# EAGLE design S5D3_MCU_only_edge_Power_SPI (EAGLE 9.6.2)
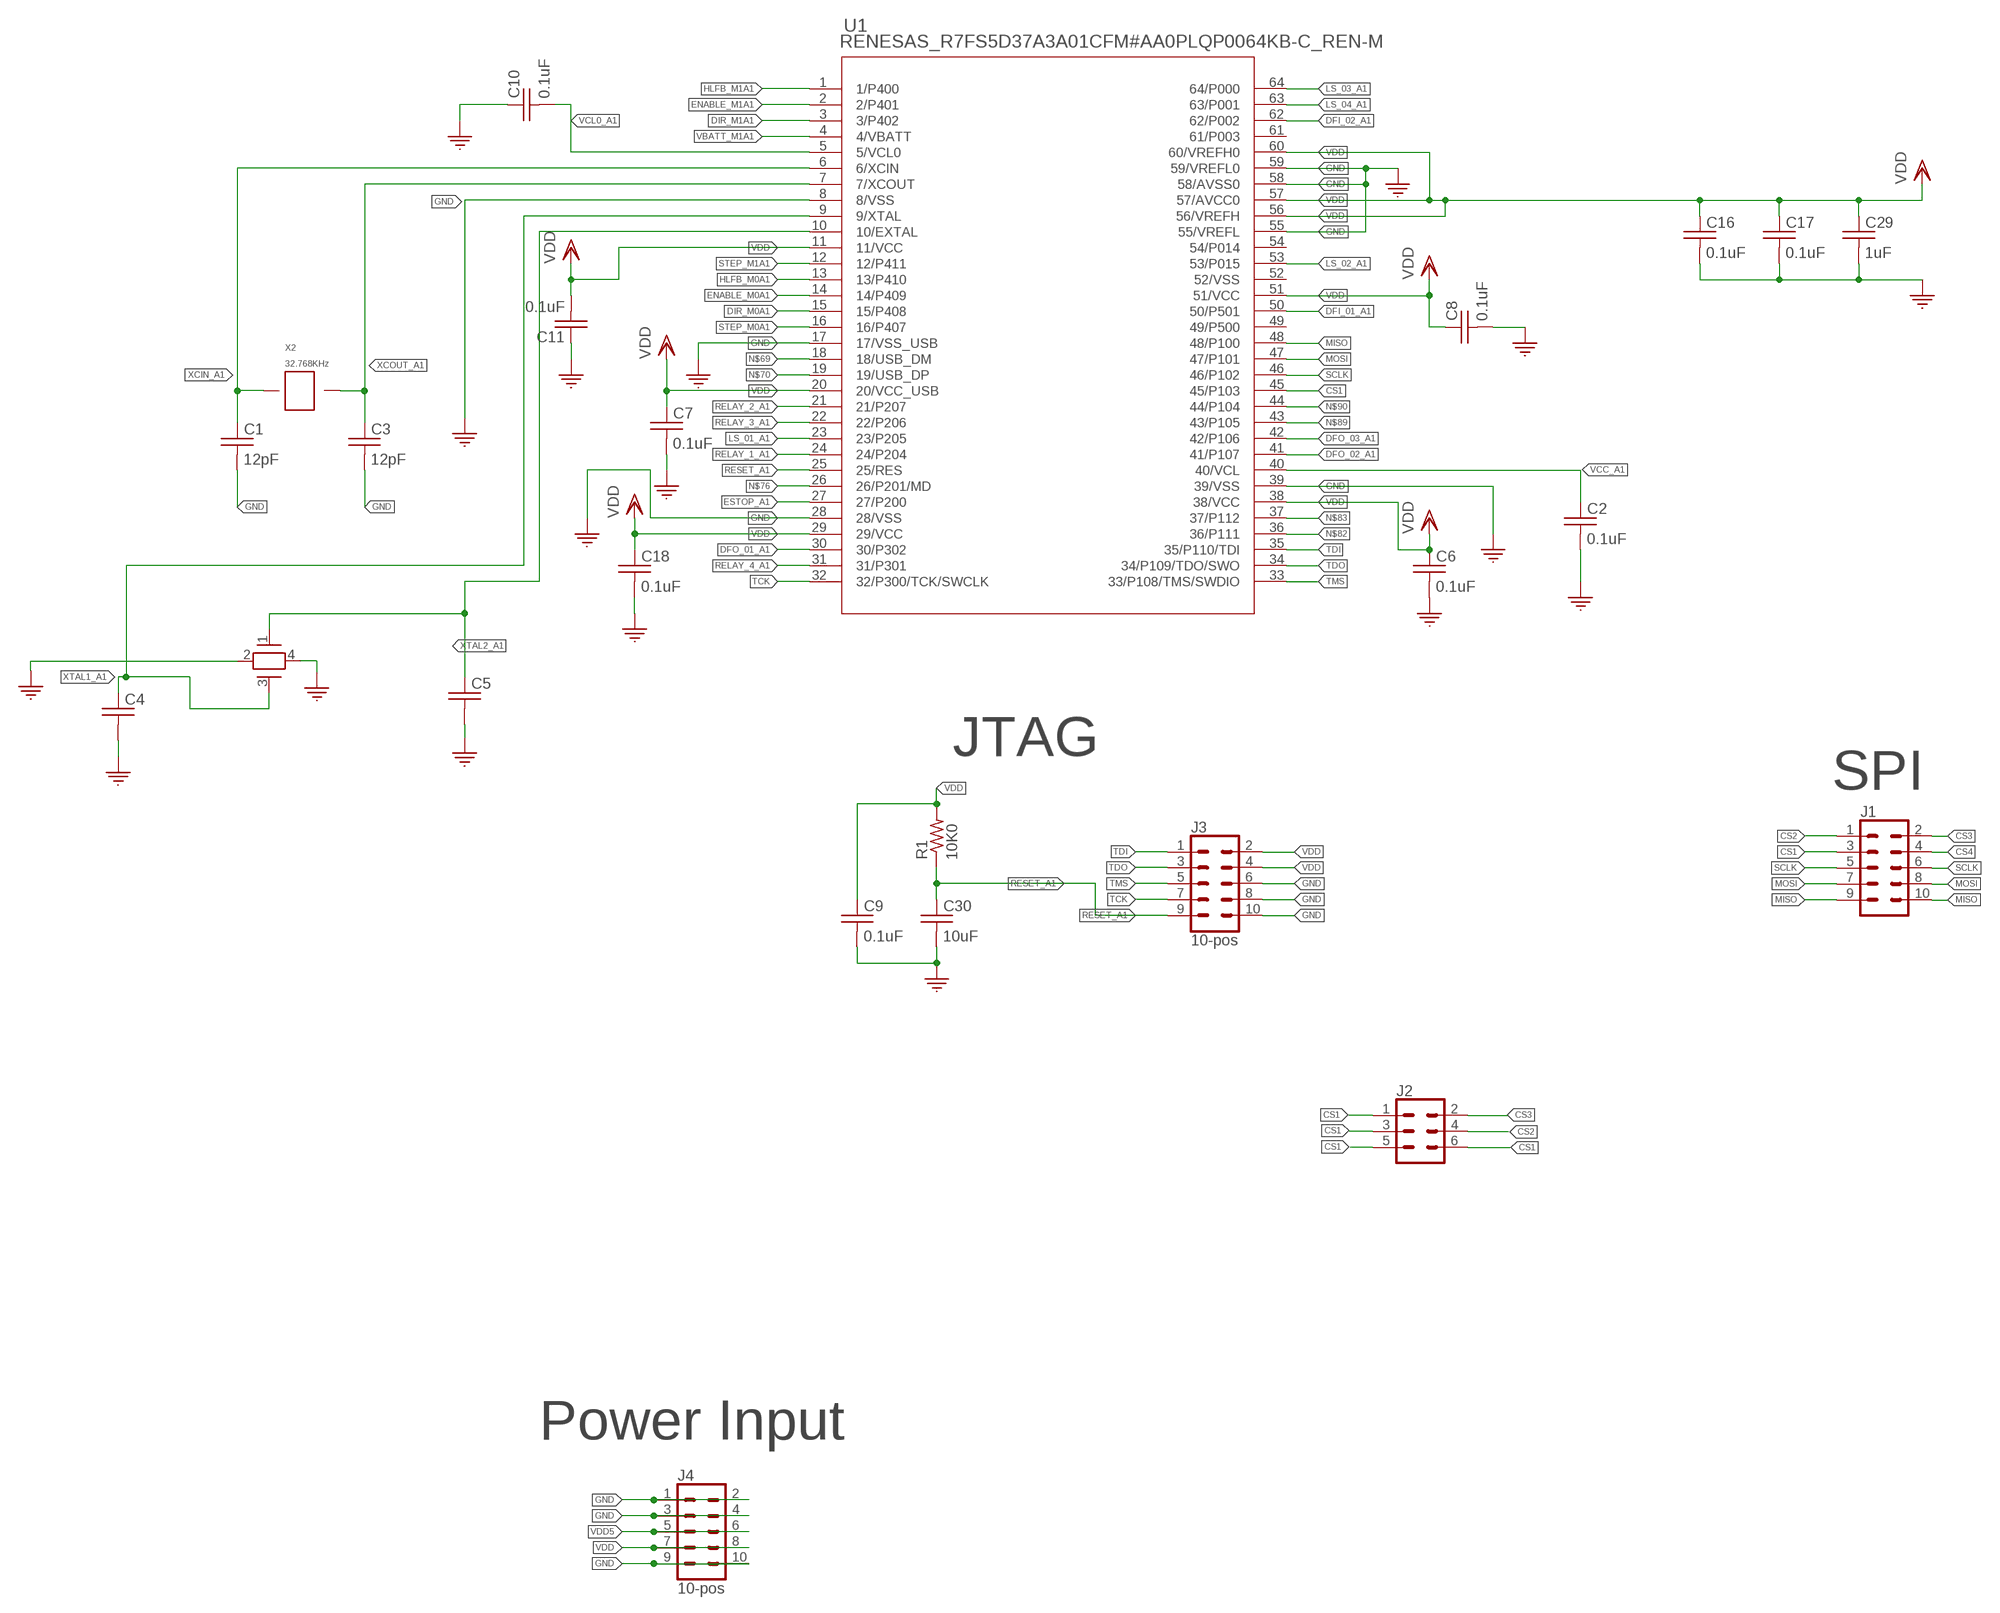
[diagram p0: schematic, sheet 1]

## Parts
C1  12pF  C_0402_12PF  [0402]
C2  0.1uF  C_0402_0.1UF  [0402]
C3  12pF  C_0402_12PF  [0402]
C4  10pF  C_0402_10PF  [0402]
C5  10pF  C_0402_10PF  [0402]
C6  0.1uF  C_0402_0.1UF  [0402]
C7  0.1uF  C_0402_0.1UF  [0402]
C8  0.1uF  C_0402_0.1UF  [0402]
C9  0.1uF  C_0402_0.1UF  [0402]
C10  0.1uF  C_0402_0.1UF  [0402]
C11  0.1uF  C_0402_0.1UF  [0402]
C16  0.1uF  C_0402_0.1UF  [0402]
C17  0.1uF  C_0402_0.1UF  [0402]
C18  0.1uF  C_0402_0.1UF  [0402]
C29  1uF  C_0402_1UF  [0402]
C30  10uF  C_0402_10UF  [0402]
J1  CONN_05X2PTH  [2X5]
J2  CONN_03X2  [2X3]
J3  10-pos  CONN_05X2_RAPTH  [2X5]
J4  10-pos  CONN_05X2_RAPTH  [2X5]
R1  10K0  R_0402_10K0  [0402]
U1  RENESAS_R7FS5D37A3A01CFM#AA0PLQP0064KB-C_REN-M  [PLQP0064KB-C_REN-M]
X2  32.768KHz  XTAL_32.768KHZ  [SMD_X_2_PADS]
Y1  XTAL_12MHZ_ABM8G-12.000MHZ-B4Y-T  [CRYSTAL_ABM8G_ABR]

## Nets
CS1: J1.3 J2.1 J2.3 J2.5 J2.6 U1.45(45/P103)
CS2: J1.1 J2.4
CS3: J1.2 J2.2
CS4: J1.4
DFI_01_A1: U1.50(50/P501)
DFI_02_A1: U1.62(62/P002)
DFO_01_A1: U1.30(30/P302)
DFO_02_A1: U1.41(41/P107)
DFO_03_A1: U1.42(42/P106)
DIR_M0A1: U1.15(15/P408)
DIR_M1A1: U1.3(3/P402)
ENABLE_M0A1: U1.14(14/P409)
ENABLE_M1A1: U1.2(2/P401)
ESTOP_A1: U1.27(27/P200)
GND: C1.P$2 C2.P$2 C3.P$2 C4.P$2 C5.P$2 C6.P$2 C7.P$2 C8.P$2 C9.P$2 C10.P$1 C11.P$1 C16.P$2 C17.P$2 C18.P$2 C29.P$2 C30.P$2 J3.6 J3.8 J3.10 J4.1 J4.2 J4.3 J4.4 J4.9 J4.10 U1.8(8/VSS) U1.17(17/VSS_USB) U1.28(28/VSS) U1.39(39/VSS) U1.55(55/VREFL) U1.58(58/AVSS0) U1.59(59/VREFL0) Y1.2 Y1.4
HLFB_M0A1: U1.13(13/P410)
HLFB_M1A1: U1.1(1/P400)
LS_01_A1: U1.23(23/P205)
LS_02_A1: U1.53(53/P015)
LS_03_A1: U1.64(64/P000)
LS_04_A1: U1.63(63/P001)
MISO: J1.9 J1.10 U1.48(48/P100)
MOSI: J1.7 J1.8 U1.47(47/P101)
N$69: U1.18(18/USB_DM)
N$70: U1.19(19/USB_DP)
N$76: U1.26(26/P201/MD)
N$82: U1.36(36/P111)
N$83: U1.37(37/P112)
N$89: U1.43(43/P105)
N$90: U1.44(44/P104)
RELAY_1_A1: U1.24(24/P204)
RELAY_2_A1: U1.21(21/P207)
RELAY_3_A1: U1.22(22/P206)
RELAY_4_A1: U1.31(31/P301)
RESET_A1: C30.P$1 J3.9 R1.P$1 U1.25(25/RES)
SCLK: J1.5 J1.6 U1.46(46/P102)
STEP_M0A1: U1.16(16/P407)
STEP_M1A1: U1.12(12/P411)
TCK: J3.7 U1.32(32/P300/TCK/SWCLK)
TDI: J3.1 U1.35(35/P110/TDI)
TDO: J3.3 U1.34(34/P109/TDO/SWO)
TMS: J3.5 U1.33(33/P108/TMS/SWDIO)
VBATT_M1A1: U1.4(4/VBATT)
VCC_A1: C2.P$1 U1.40(40/VCL)
VCL0_A1: C10.P$2 U1.5(5/VCL0)
VDD: C6.P$1 C7.P$1 C8.P$1 C9.P$1 C11.P$2 C16.P$1 C17.P$1 C18.P$1 C29.P$1 J3.2 J3.4 J4.7 J4.8 R1.P$2 U1.11(11/VCC) U1.20(20/VCC_USB) U1.29(29/VCC) U1.38(38/VCC) U1.51(51/VCC) U1.56(56/VREFH) U1.57(57/AVCC0) U1.60(60/VREFH0)
VDD5: J4.5 J4.6
XCIN_A1: C1.P$1 U1.6(6/XCIN) X2.P$1
XCOUT_A1: C3.P$1 U1.7(7/XCOUT) X2.P$2
XTAL1_A1: C4.P$1 U1.9(9/XTAL) Y1.3
XTAL2_A1: C5.P$1 U1.10(10/EXTAL) Y1.1
Unconnected: U1.49(49/P500) U1.52(52/VSS) U1.54(54/P014) U1.61(61/P003)

## Notes on the sheet
- JTAG
- SPI
- Power Input

## Library data of the parts
C1 C3 = 3D_MIG_Controller:C_0402_12PF; PARTNO: CL05C120JB5NNNC
C2 C6-C11 C16-C18 = 3D_MIG_Controller:C_0402_0.1UF; PARTNO: CL05F104ZO5NNNC
C4 C5 = 3D_MIG_Controller:C_0402_10PF; PARTNO: CC0402JRNPO9BN100
C29 = 3D_MIG_Controller:C_0402_1UF; PARTNO: CL05A105KO5NNNC
C30 = 3D_MIG_Controller:C_0402_10UF; PARTNO: CL05A106MP8NUB8
J1 = 3D_MIG_Controller:CONN_05X2: Multi connection point. Often used as Generic Header-pin footprint for 0.1 inch spaced/style header connections For AVR SPI programming port, see special device with nice symbol: "AVR_SPI_PROG_5x2.dev" You can populate with any combo of single row headers, but if you'd like an exact match, check these: 2x5 AVR ICSP Male Header <https://www.sparkfun.com/products/778> (PRT-00778) 2x5 Pin Shrouded Header <https://www.sparkfun.com/products/8506> (PRT-08506) On any of the 0.1 inch spaced packages, you can populate with these: Break Away Headers - Straight <https://www.sparkfun.com/products/116> (PRT-00116) Break Away Male Headers - Right Angle <https://www.sparkfun.com/products/553> (PRT-00553) Female Headers <https://www.sparkfun.com/products/115> (PRT-00115) Break Away Headers - Machine Pin <https://www.sparkfun.com/products/117> (PRT-00117) Break Away Female Headers - Swiss Machine Pin <https://www.sparkfun.com/products/743> (PRT-00743) Special note: the shrouded connector mates well with our 5x2 ribbon cables: 2x5 Pin IDC Ribbon Cable <https://www.sparkfun.com/products/8535> (PRT-08535); PROD_ID: CONN-08499; SF_ID: PRT-0778
J2 = 3D_MIG_Controller:CONN_03X2: Multi connection point. Often used as Generic Header-pin footprint for 0.1 inch spaced/style header connections For AVR SPI programming port, see special device with nice symbol: "AVR_SPI_PROG_5x2.dev" You can populate with any combo of single row headers, but if you'd like an exact match, check these: 2x5 AVR ICSP Male Header <https://www.sparkfun.com/products/778> (PRT-00778) 2x5 Pin Shrouded Header <https://www.sparkfun.com/products/8506> (PRT-08506) On any of the 0.1 inch spaced packages, you can populate with these: Break Away Headers - Straight <https://www.sparkfun.com/products/116> (PRT-00116) Break Away Male Headers - Right Angle <https://www.sparkfun.com/products/553> (PRT-00553) Female Headers <https://www.sparkfun.com/products/115> (PRT-00115) Break Away Headers - Machine Pin <https://www.sparkfun.com/products/117> (PRT-00117) Break Away Female Headers - Swiss Machine Pin <https://www.sparkfun.com/products/743> (PRT-00743) Special note: the shrouded connector mates well with our 5x2 ribbon cables: 2x5 Pin IDC Ribbon Cable <https://www.sparkfun.com/products/8535> (PRT-08535)
J3 J4 = 3D_MIG_Controller:CONN_05X2_RA: Connector Header Through Hole, Right Angle 10 position 0.100" (2.54mm); PARTNO: PH2RA-10-UA
R1 = 3D_MIG_Controller:R_0402_10K0; PARTNO: RMCF0402JT10K0
U1 = 3D_MIG_Controller:RENESAS_R7FS5D37A3A01CFM#AA0; COPYRIGHT: Copyright (C) 2023 Ultra Librarian. All rights reserved.; MFR_NAME: Renesas Electronics; PARTNO: R7FS3A37A3A01CFM#AA0
X2 = 3D_MIG_Controller:XTAL_32.768KHZ; PARTNO: ABS07-32.768KHZ-T
Y1 = 3D_MIG_Controller:XTAL_12MHZ_ABM8G-12.000MHZ-B4Y-T; COPYRIGHT: Copyright (C) 2023 Ultra Librarian. All rights reserved.; MFR_NAME: Abracon; PARTNO: ABM8G-12.000MHZ-B4Y-T

## Board
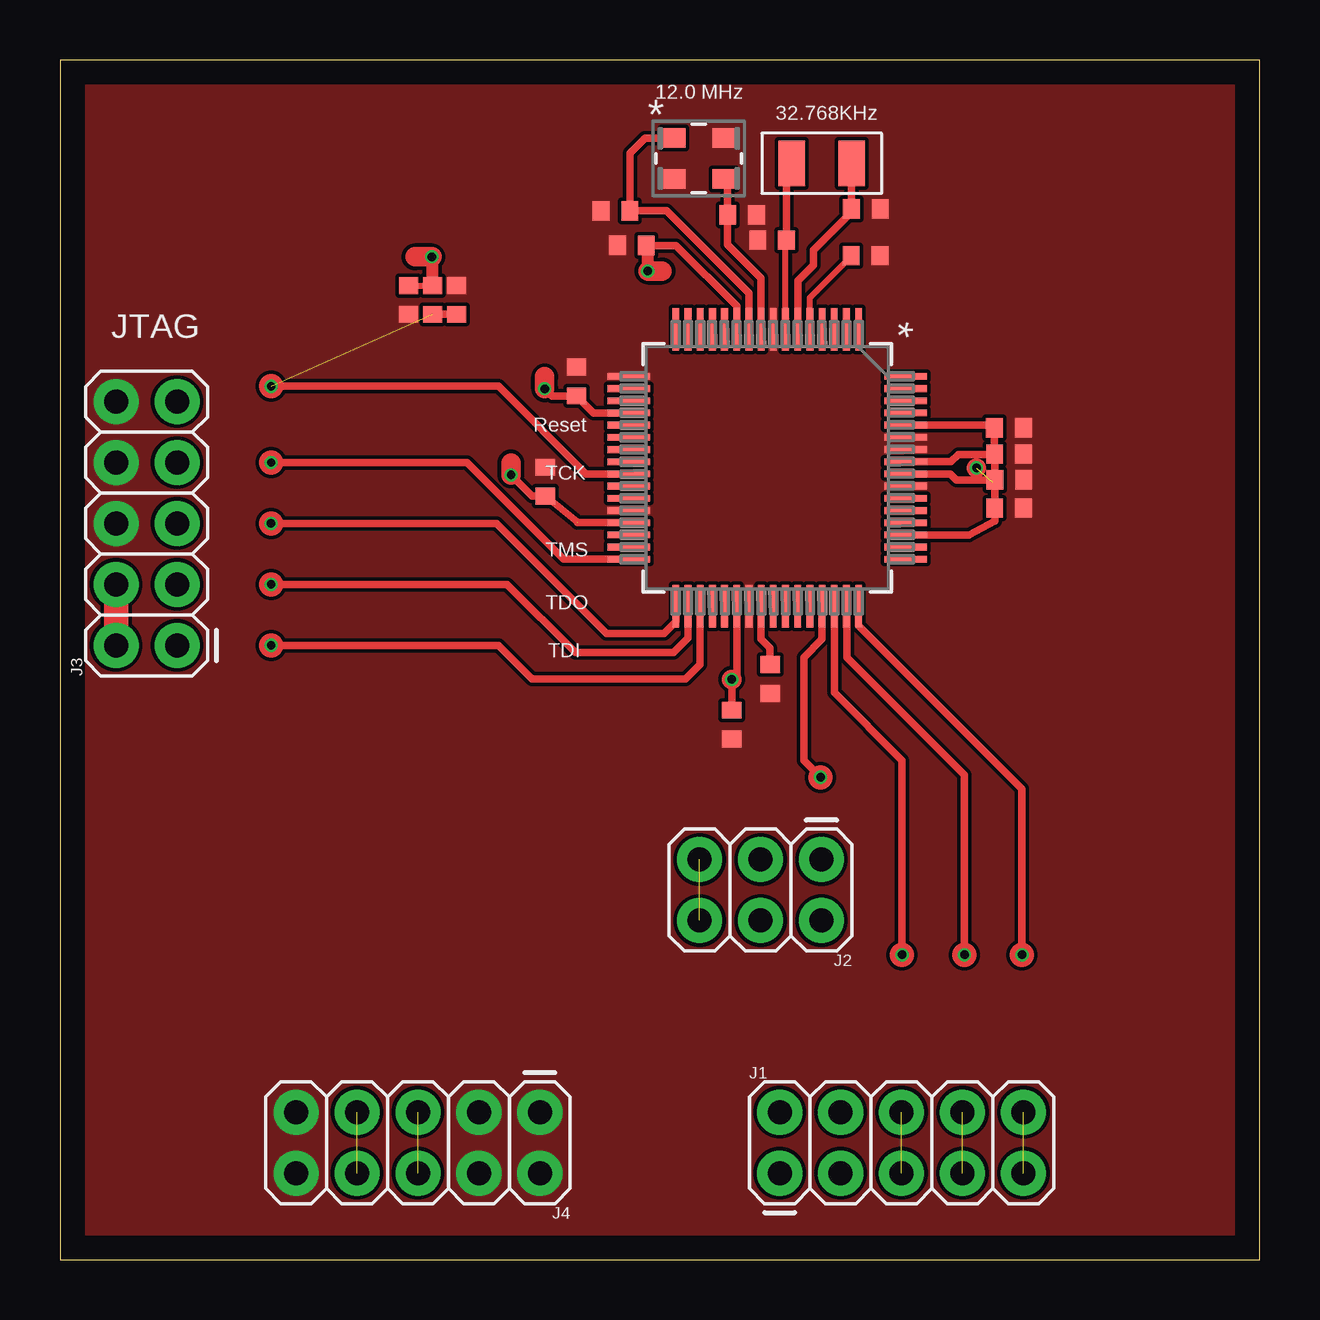
[diagram p1: board, top side]
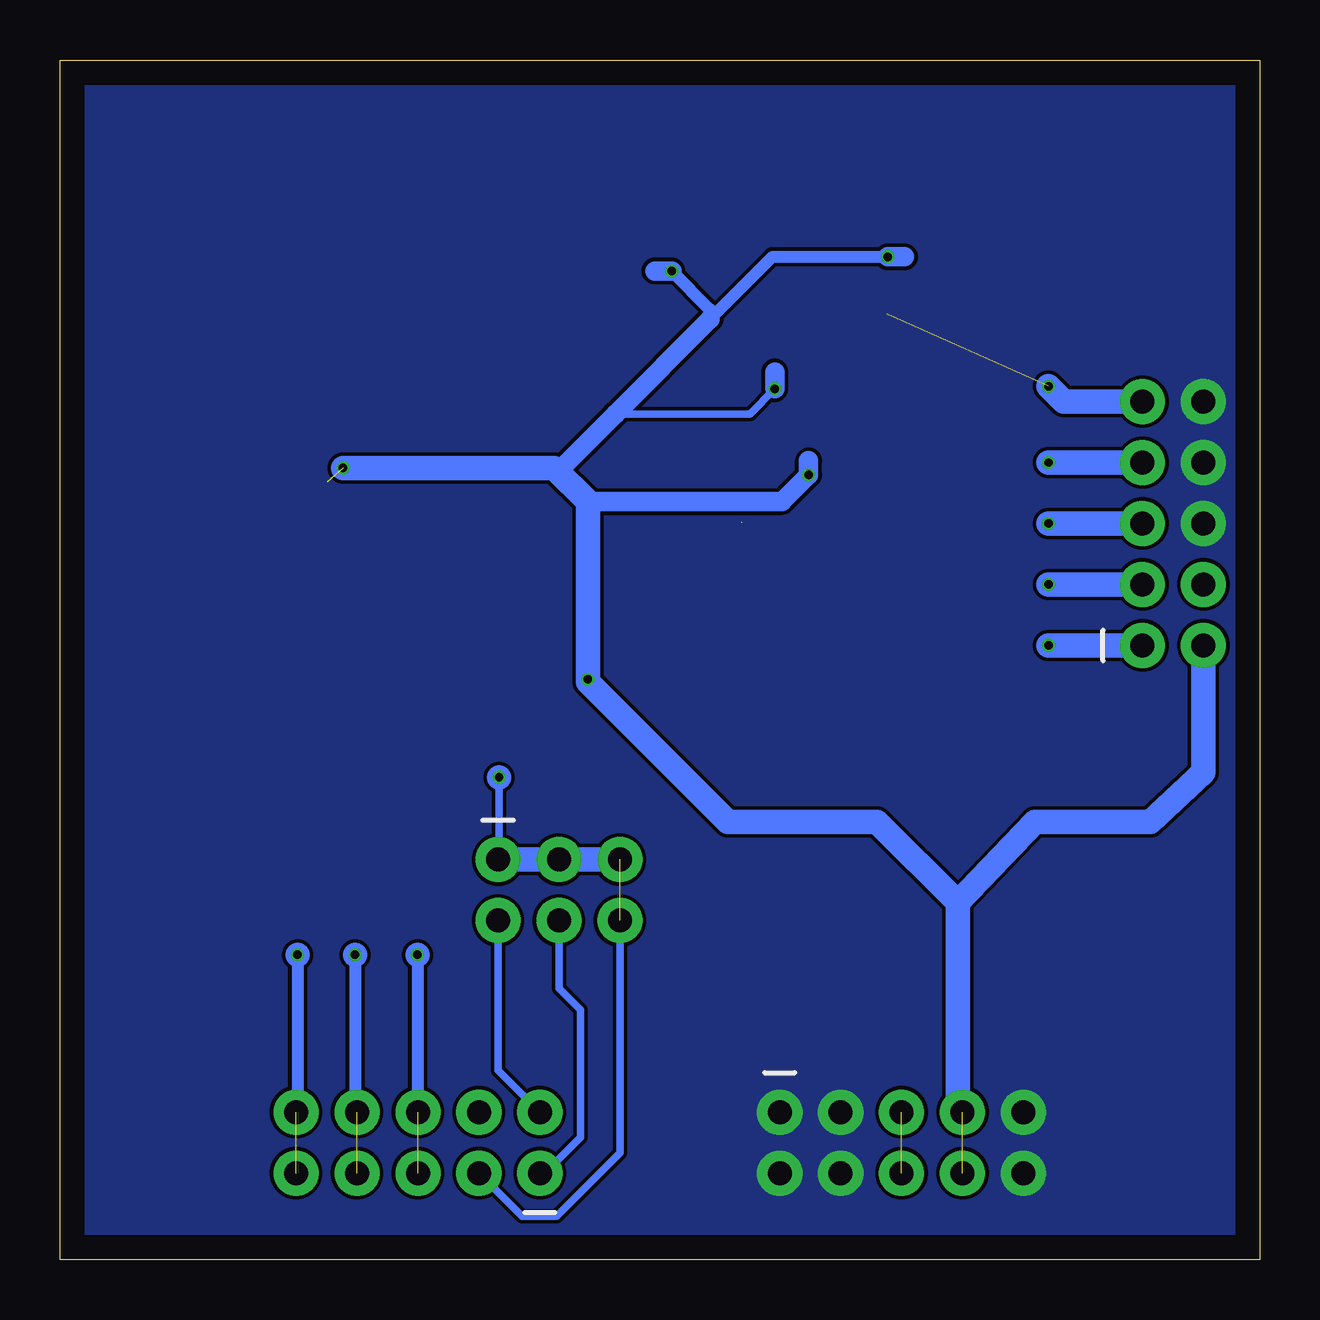
[diagram p2: board, bottom side, seen from below]

Size 50 x 50 mm. Coordinates in mm from the lower left corner, seen from the top.
Outline: 0,0 50,0 50,50 0,50 0,0
Copper layers (1*16): Top 0.035mm / dielectric 1.5mm / Bottom 0.035mm
Design rules "default": minimum track width 6mil, minimum drill 0.2mm, track to track 6mil, track to pad 6mil, pad to pad 6mil, via to via 6mil, smd to smd 6mil, copper to edge 40mil, drill to drill 6mil, minimum pad ring 10mil, minimum via ring 4mil, stop-mask expansion 4mil, vias tented up to drill 0mil, thermal gap 10mil

### Footprints (pad centres in the part's own frame; a part is rotated, then mirrored left to right if it is on the bottom)
0402 = smd 0.8 x 0.7: P$1 0,0.6; P$2 0,-0.6
2X5 = drill 1 pad 1.88: 1 0,0; 2 0,2.54; 3 2.54,0; 4 2.54,2.54; 5 5.08,0; 6 5.08,2.54; 7 7.62,0; 8 7.62,2.54; 9 10.16,0; 10 10.16,2.54
2X3 = drill 1 pad 1.88: 1 -2.54,-1.27; 2 -2.54,1.27; 3 0,-1.27; 4 0,1.27; 5 2.54,-1.27; 6 2.54,1.27
PLQP0064KB-C_REN-M = smd 1.778 x 0.279: 1 -5.766,3.81; 2 -5.766,3.302; 3 -5.766,2.794; 4 -5.766,2.286; 5 -5.766,1.778; 6 -5.766,1.27; 7 -5.766,0.762; 8 -5.766,0.254; 9 -5.766,-0.254; 10 -5.766,-0.762; 11 -5.766,-1.27; 12 -5.766,-1.778; 13 -5.766,-2.286; 14 -5.766,-2.794; 15 -5.766,-3.302; 16 -5.766,-3.81; 33 5.766,-3.81; 34 5.766,-3.302; 35 5.766,-2.794; 36 5.766,-2.286; 37 5.766,-1.778; 38 5.766,-1.27; 39 5.766,-0.762; 40 5.766,-0.254; 41 5.766,0.254; 42 5.766,0.762; 43 5.766,1.27; 44 5.766,1.778; 45 5.766,2.286; 46 5.766,2.794; 47 5.766,3.302; 48 5.766,3.81 | smd 0.279 x 1.778: 17 -3.81,-5.766; 18 -3.302,-5.766; 19 -2.794,-5.766; 20 -2.286,-5.766; 21 -1.778,-5.766; 22 -1.27,-5.766; 23 -0.762,-5.766; 24 -0.254,-5.766; 25 0.254,-5.766; 26 0.762,-5.766; 27 1.27,-5.766; 28 1.778,-5.766; 29 2.286,-5.766; 30 2.794,-5.766; 31 3.302,-5.766; 32 3.81,-5.766; 49 3.81,5.766; 50 3.302,5.766; 51 2.794,5.766; 52 2.286,5.766; 53 1.778,5.766; 54 1.27,5.766; 55 0.762,5.766; 56 0.254,5.766; 57 -0.254,5.766; 58 -0.762,5.766; 59 -1.27,5.766; 60 -1.778,5.766; 61 -2.286,5.766; 62 -2.794,5.766; 63 -3.302,5.766; 64 -3.81,5.766
SMD_X_2_PADS = smd 1.9 x 1.1: P$1 0,1.25; P$2 0,-1.25
CRYSTAL_ABM8G_ABR = smd 0.991 x 0.813: 1 -1.054,0.85; 2 -1.054,-0.85; 3 1.054,-0.85; 4 1.054,0.85

### Placement (x,y rotation side)
C1  33.59,43.79 90 top
C2  29.6,24.2 0 top
C3  29.68,42.49 270 top
C4  28.43,43.54 90 top
C5  23.15,43.71 270 top
C6  28,22.3 0 top
C7  21.53,36.6 180 top
C8  39.56,31.32 90 top
C9  14.53,40 0 top
C10  33.58,41.85 270 top
C11  23.84,42.27 90 top
C16  39.57,32.5 90 top
C17  39.56,33.57 90 top
C18  20.23,32.42 180 top
C29  39.55,34.67 90 top
C30  16.53,40 180 top
J1  30,3.6 0 top
J2  29.2,15.4 180 top
J3  4.88,25.6 90 top
J4  20,6.14 180 top
R1  15.53,40 180 top
U1  29.48,33 270 top
X2  31.75,45.69 270 top
Y1  26.63,45.9 0 top

### Tracks (layer width: path | path; a pad name or v marks a point on that pad's centre or on a via)
CS1  (via drill 0.35)  (1 unrouted)
  Top 0.305: U1.45 31.77,25.87 31,25.1 31,20.8 v31.7,20.1
  Top 1.016: v31.7,20.1
  Bottom 0.305: v31.7,20.1 31.7,16.71 J2.1 | J1.3 30.74,1.8 29.3,1.8 26.66,4.44 J2.6
  Bottom 1.016: J2.1 J2.3 J2.5 | v31.7,20.1
CS2
  Bottom 0.305: J1.1 29.8,3.6 28.3,5.1 28.3,10.4 29.2,11.3 J2.4
CS3
  Bottom 0.305: J1.2 31.74,7.88 J2.2
GND
  pour Top (no thermals): 0,50 50,50 50,0 0,0
  pour Bottom (no thermals): 0,50 50,50 50,0 0,0
MISO  (via drill 0.35)  (1 unrouted)
  Top 0.305: U1.48 33.29,26.43 40.1,19.62 v40.1,12.7
  Top 1.016: v40.1,12.7
  Bottom 0.508: v40.1,12.7 40.1,6.2 J1.10
  Bottom 1.016: v40.1,12.7
MOSI  (via drill 0.35)  (1 unrouted)
  Top 0.305: U1.47 32.8,27.22 32.8,25.1 37.7,20.2 v37.7,12.7
  Top 1.016: v37.7,12.7
  Bottom 0.508: v37.7,12.7 37.7,6.22 J1.8
  Bottom 1.016: v37.7,12.7
RESET_A1  (via drill 0.35)  (1 unrouted)
  Top 0.305: C30.P$1 R1.P$1 | U1.25 21.93,32.75 18.28,36.4 v8.8,36.4
  Top 1.016: v8.8,36.4
  Bottom 1.016: v8.8,36.4 8.16,35.76 J3.9
SCLK  (via drill 0.35)  (1 unrouted)
  Top 0.305: v35.1,12.7 35.1,20.8 32.27,23.63 U1.46
  Top 1.016: v35.1,12.7
  Bottom 0.508: v35.1,12.7 35.1,6.16 J1.6
  Bottom 1.016: v35.1,12.7
TCK  (via drill 0.35)
  Top 0.305: U1.32 20.99,29.19 16.96,33.22 v8.8,33.22
  Top 1.016: v8.8,33.22
  Bottom 1.016: v8.8,33.22 J3.7
TDI  (via drill 0.35)
  Top 0.305: U1.35 26.69,24.81 26.08,24.2 19.68,24.2 18.28,25.6 v8.8,25.6
  Top 1.016: v8.8,25.6
  Bottom 1.016: v8.8,25.6 J3.1
TDO  (via drill 0.35)
  Top 0.305: U1.34 26.18,25.9 25.58,25.3 21.48,25.3 18.64,28.14 v8.8,28.14
  Top 1.016: v8.8,28.14
  Bottom 1.016: v8.8,28.14 J3.3
TMS  (via drill 0.35)
  Top 0.305: U1.33 25.67,26.59 25.18,26.1 22.78,26.1 18.2,30.68 v8.8,30.68
  Top 1.016: v8.8,30.68
  Bottom 1.016: v8.8,30.68 J3.5
VCC_A1
  Top 0.305: U1.40 29.23,25.87 29.6,25.5 C2.P$1
VCL0_A1
  Top 0.254: U1.5 31.26,40.09 32.97,41.8 C10.P$2
VDD  (via drill 0.35)  (3 unrouted)
  Top 0.254: C9.P$1 15.5,40.6 R1.P$2 | 24.58,42.27 C11.P$2 | 20.08,31.82 C18.P$1
  Top 0.305: 21.58,30.73 C18.P$1 | U1.11 28.21,39.74 25.68,42.27 24.58,42.27 | U1.20 22.24,35.29 C7.P$1 20.5,36 v20.2,36.3 | U1.29 21.58,30.71 | U1.38 28.21,24.39 v28,24.18 C6.P$1 | C16.P$1 C8.P$1 38.96,30.78 37.88,30.21 U1.51 | C16.P$1 | C16.P$1 C17.P$1 | C17.P$1 C29.P$1 | 38.87,32.4 C16.P$1 | U1.57 37.13,33.25 37.44,33.56 C17.P$1 | 38.88,34.6 C29.P$1 | C29.P$1 38.84,34.78 U1.60 | U1.56 37.12,32.75 37.37,32.5 C16.P$1 | v18.8,32.7 19.68,31.82 20.08,31.82
  Top 0.508: v15.5,41.8 15.5,40.6 | v24.5,41.2 24.5,42.19 24.58,42.27
  Top 0.813: v38.2,33 v38.2,32.99 | v24.5,41.2 25.1,41.2 | v15.5,41.8 14.8,41.8 | v18.8,32.7 18.8,33.2 | v20.2,36.3 20.2,36.8 | v28,24.18 v27.99,24.18
  Top 1.016: J3.2 J3.4 2.31,28.17
  Bottom 0.305: 26.85,35.25 21.25,35.25 v20.2,36.3
  Bottom 0.508: v15.5,41.8 20.3,41.8 22.9,39.2 22.9,39.6 v24.5,41.2
  Bottom 0.813: 28,31.6 19.9,31.6 v18.8,32.7 18.8,33.3 | 29.4,33 29.1,33 26.85,35.25 22.9,39.2 | v24.5,41.2 25.2,41.2 | v15.5,41.8 14.8,41.8 | v20.2,36.3 20.2,37
  Bottom 1.016: J4.7 12.58,6.34 12.58,14.88 | J3.2 2.34,20.3 4.54,18.24 9.36,18.24 12.58,14.88 | v38.2,33 29.4,33 28,31.6 v28,24.18 28,24.08 22.16,18.24 15.94,18.24 12.58,14.88
VDD5  (1 unrouted)
XCIN_A1
  Top 0.254: 30.75,38.9 U1.6
  Top 0.305: X2.P$1 C1.P$1 32.99,43.67 31.4,42.08 31.4,41.45 30.75,40.8 30.75,38.9
XCOUT_A1
  Top 0.152: X2.P$2 30.34,45.84 30.34,46.44
  Top 0.254: U1.7 30.24,42.45 C3.P$1
  Top 0.305: C3.P$1 30.28,46.37 30.34,46.44
XTAL1_A1
  Top 0.152: 27.83,43.5 C4.P$1
  Top 0.254: 27.83,43.3 27.83,43.5
  Top 0.305: U1.9 29.23,40.9 27.83,42.3 27.83,43.3 | Y1.3 27.83,44.9 C4.P$1
XTAL2_A1
  Top 0.305: Y1.1 24.38,46.75 23.75,46.12 C5.P$1 25.28,43.71 28.72,40.27 U1.10

### Text on the board
tPlace: 12.0 MHz | 32.768KHz | JTAG | Reset | TCK | TMS | TDO | TDI